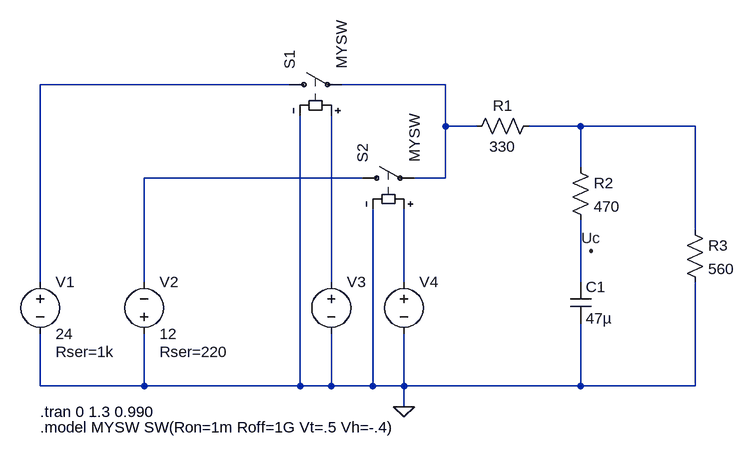
[diagram p0: schematic W11-1.asc]
W11-1.asc, the LTspice schematic file:
Version 4
SHEET 1 880 680
WIRE -144 -16 -528 -16
WIRE 96 -16 -64 -16
WIRE 96 48 96 -16
WIRE 144 48 96 48
WIRE 304 48 224 48
WIRE 480 48 304 48
WIRE 304 112 304 48
WIRE -32 128 -368 128
WIRE 96 128 96 48
WIRE 96 128 48 128
WIRE 480 208 480 48
WIRE -528 288 -528 -16
WIRE -368 288 -368 128
WIRE -80 288 -80 32
WIRE 32 288 32 176
WIRE 304 288 304 192
WIRE -528 448 -528 368
WIRE -368 448 -368 368
WIRE -368 448 -528 448
WIRE -128 448 -128 32
WIRE -128 448 -368 448
WIRE -80 448 -80 368
WIRE -80 448 -128 448
WIRE -16 448 -16 176
WIRE -16 448 -80 448
WIRE 32 448 32 368
WIRE 32 448 -16 448
WIRE 304 448 304 352
WIRE 304 448 32 448
WIRE 480 448 480 288
WIRE 480 448 304 448
WIRE 32 480 32 448
FLAG 32 480 0
FLAG 320 240 Uc
SYMBOL voltage -528 272 R0
WINDOW 123 0 0 Left 2
WINDOW 39 24 124 Left 2
SYMATTR SpiceLine Rser=1k
SYMATTR InstName V1
SYMATTR Value 24
SYMBOL voltage -368 384 M180
WINDOW 0 24 96 Left 2
WINDOW 3 24 16 Left 2
WINDOW 123 0 0 Left 2
WINDOW 39 24 -12 Left 2
SYMATTR InstName V2
SYMATTR Value 12
SYMATTR SpiceLine Rser=220
SYMBOL voltage -80 272 R0
WINDOW 123 0 0 Left 2
WINDOW 39 0 0 Left 2
WINDOW 3 24 96 Invisible 2
SYMATTR Value PWL(0 1 1 1 1.000001 0 1.06 0 1.060001 1)
SYMATTR InstName V3
SYMBOL voltage 32 272 R0
WINDOW 123 0 0 Left 2
WINDOW 39 0 0 Left 2
WINDOW 3 24 96 Invisible 2
SYMATTR Value PWL(0 0 1 0 1.000001 1 1.06 1 1.060001 0)
SYMATTR InstName V4
SYMBOL sw -160 -16 R270
SYMATTR InstName S1
SYMATTR Value MYSW
SYMBOL sw -48 128 R270
SYMATTR InstName S2
SYMATTR Value MYSW
SYMBOL res 128 64 R270
WINDOW 0 32 56 VTop 2
WINDOW 3 0 56 VBottom 2
SYMATTR InstName R1
SYMATTR Value 330
SYMBOL res 288 96 R0
SYMATTR InstName R2
SYMATTR Value 470
SYMBOL res 464 192 R0
SYMATTR InstName R3
SYMATTR Value 560
SYMBOL cap 288 288 R0
SYMATTR InstName C1
SYMATTR Value 47µ
TEXT -528 512 Left 2 !.model MYSW SW(Ron=1m Roff=1G Vt=.5 Vh=-.4)
TEXT -528 488 Left 2 !.tran 0 1.3 0.990

The netlist it stands for:
* W11-1.asc
V1 N001 0 24 Rser=1k
V2 0 N004 12 Rser=220
V3 N005 0 PWL(0 1 1 1 1.000001 0 1.06 0 1.060001 1)
V4 N006 0 PWL(0 0 1 0 1.000001 1 1.06 1 1.060001 0)
S1 N001 N002 N005 0 MYSW
S2 N004 N002 N006 0 MYSW
R1 N002 N003 330
R2 N003 N007 470
R3 N003 0 560
C1 N007 0 47µ
.model MYSW SW(Ron=1m Roff=1G Vt=.5 Vh=-.4)
.tran 0 1.3 0.990
.backanno
.end